# Altium schematic sheet 2_Battery indicator.schdoc
size 497 x 243 mm; Name: A_A4; Symbol: A_A4; Device: A_A4; @Project Name: TUD-EnergyHarvestingConsole_2022-08-29_17-01-09; REV: 1.0; Date: 2022-07-30; Sheet: 1/1; Draw By: Alejandro Cabrerizo; Convert to PCB: yes; Add into BOM: yes
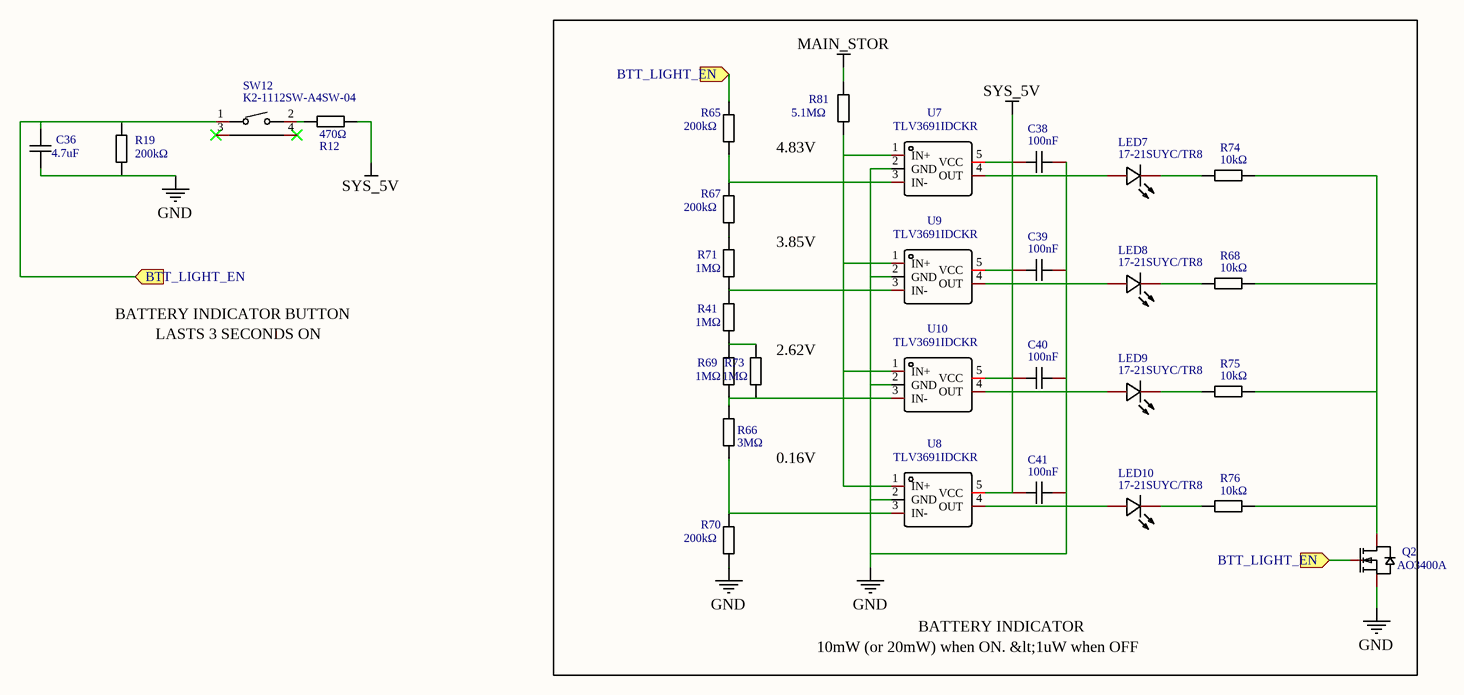
[diagram p0: 2_Battery indicator.schdoc]

## Parts
C36  4.7uF  [C0603]
C38  100nF  [C0603]
C39  100nF  [C0603]
C40  100nF  [C0603]
C41  100nF  [C0603]
LED7  17-21SUYC/TR8  [LED0805-RD]
LED8  17-21SUYC/TR8  [LED0805-RD]
LED9  17-21SUYC/TR8  [LED0805-RD]
LED10  17-21SUYC/TR8  [LED0805-RD]
Q2  AO3400A  [SOT-23-3_L2.9-W1.3-P1.90-LS2.4-BR]
R12  470Ω  [R0603]
R19  200kΩ  [R0603]
R41  1MΩ  [R0603]
R65  200kΩ  [R0603]
R66  3MΩ  [R0603]
R67  200kΩ  [R0603]
R68  10kΩ  [R0603]
R69  1MΩ  [R0603]
R70  200kΩ  [R0603]
R71  1MΩ  [R0603]
R73  1MΩ  [R0603]
R74  10kΩ  [R0603]
R75  10kΩ  [R0603]
R76  10kΩ  [R0603]
R81  5.1MΩ  [R0603]
SW12  K2-1112SW-A4SW-04  [KEY-TH_K2-1112SW-AXXW-XX]
U7  TLV3691IDCKR  [SC-70-5_L2.1-W1.3-P0.65-LS2.1-BR]
U8  TLV3691IDCKR  [SC-70-5_L2.1-W1.3-P0.65-LS2.1-BR]
U9  TLV3691IDCKR  [SC-70-5_L2.1-W1.3-P0.65-LS2.1-BR]
U10  TLV3691IDCKR  [SC-70-5_L2.1-W1.3-P0.65-LS2.1-BR]

## Ports
BTT_LIGHT_EN (in)

## Nets
GND: C36.1 C38.2 C39.2 C40.2 C41.2 Q2.2(S) R19.2 R70.1 U7.2(GND) U8.2(GND) U9.2(GND) U10.2(GND)
MAIN_STOR: R81.1
SYS_5V: C38.1 C39.1 C40.1 C41.1 R12.2 U7.5(VCC) U8.5(VCC) U9.5(VCC) U10.5(VCC)
BTT_LIGHT_EN: C36.2 Q2.1(G) R19.1 R65.2 SW12.1 ; port BTT_LIGHT_EN
NetLED7_1: LED7.1(-) R74.1
NetLED7_2: LED7.2(+) U7.4(OUT)
NetLED8_1: LED8.1(-) R68.1
NetLED8_2: LED8.2(+) U9.4(OUT)
NetLED9_1: LED9.1(-) R75.1
NetLED9_2: LED9.2(+) U10.4(OUT)
NetLED10_1: LED10.1(-) R76.1
NetLED10_2: LED10.2(+) U8.4(OUT)
NetQ2_3: Q2.3(D) R68.2 R74.2 R75.2 R76.2
NetR12_1: R12.1 SW12.2
NetR41_1: R41.1 R69.2 R73.2
NetR41_2: R41.2 R71.1 U9.3(IN-)
NetR65_1: R65.1 R67.2 U7.3(IN-)
NetR66_1: R66.1 R70.2 U8.3(IN-)
NetR66_2: R66.2 R69.1 R73.1 U10.3(IN-)
NetR67_1: R67.1 R71.2
NetR81_2: R81.2 U7.1(IN+) U8.1(IN+) U9.1(IN+) U10.1(IN+)

Not connected (* = marked no-connect by the designer): SW12 3* 4*

## Notes on the sheet
- 4.83V
- 3.85V
- BATTERY INDICATOR BUTTON
- LASTS 3 SECONDS ON
- (near R73) 2.62V
- 0.16V
- 10mW (or 20mW) when ON. &lt;1uW when OFF
- BATTERY INDICATOR
- 1
- 2
- 3
- 4
- 5
- A
- B
- C
- D
- TITLE:
- TUD-EnergyHarvestingConsole_2022-08-29_17-01-09
- REV:
- 1.0
- Date:
- Company:
- 2022-07-30
- Drawn By:
- Alejandro Cabrerizo
- Sheet:
- 1/1

## Library data of the parts
C36 = CL10A475KO8NNNC: Manufacturer: SAMSUNG; Convert to PCB: yes; Name: 4.7uF; Symbol: 4.7uF; Device: CL10A475KO8NNNC; Supplier: LCSC; Manufacturer Part: CL10A475KO8NNNC; Supplier Part: C19666; JLCPCB Part Class: Basic Part; Add into BOM: yes; Origin Footprint: C0603
C38-C41 = CC0603KRX7R9BB104: Manufacturer: YAGEO; Convert to PCB: yes; Name: 100nF; Symbol: 100nF; Device: CC0603KRX7R9BB104; Supplier: LCSC; Manufacturer Part: CC0603KRX7R9BB104; Supplier Part: C14663; JLCPCB Part Class: Basic; Add into BOM: yes; Origin Footprint: C0603
LED7-LED10 = 17-21SUYC/TR8: Manufacturer: KENTO; Convert to PCB: yes; Name: 17-21SUYC/TR8; Symbol: 17-21SUYC/TR8; Device: 17-21SUYC/TR8; Supplier: LCSC; Manufacturer Part: 17-21SUYC/TR8; Supplier Part: C2296; JLCPCB Part Class: Basic Part; Add into BOM: yes; Origin Footprint: LED0805-RD
Q2 = AO3400A: Manufacturer: HUASHUO(华朔); Convert to PCB: yes; Name: AO3400A; Symbol: AO3400A; Device: AO3400A; Supplier: LCSC; Supplier Part: C700953; Manufacturer Part: AO3400A; JLCPCB Part Class: Extended Part; Add into BOM: yes; Origin Footprint: SOT-23-3_L2.9-W1.3-P1.90-LS2.4-BR
R12 = 0603WAF4700T5E: Manufacturer: UniOhm; Resistance: 470; Convert to PCB: yes; Name: 470Ω; Symbol: 470Ω; Device: 0603WAF4700T5E; Supplier: LCSC; Manufacturer Part: 0603WAF4700T5E; Supplier Part: C23179; JLCPCB Part Class: Basic Part; Add into BOM: yes; Origin Footprint: R0603
R19 R65 R67 R70 = 0603WAF2003T5E: Manufacturer: UniOhm; Resistance: 200K; Convert to PCB: yes; Name: 200kΩ; Symbol: 200kΩ; Device: 0603WAF2003T5E; Supplier: LCSC; Manufacturer Part: 0603WAF2003T5E; Supplier Part: C25811; JLCPCB Part Class: Basic Part; Add into BOM: yes; Origin Footprint: R0603
R41 R69 R71 R73 = 0603WAF1004T5E: Manufacturer: UniOhm; Resistance: 1M; Convert to PCB: yes; Name: 1MΩ; Symbol: 1MΩ; Device: 0603WAF1004T5E; Supplier: LCSC; Manufacturer Part: 0603WAF1004T5E; Supplier Part: C22935; JLCPCB Part Class: Basic Part; Add into BOM: yes; Origin Footprint: R0603
R66 = 0603WAF3004T5E: Manufacturer: UniOhm; Resistance: 3M; Convert to PCB: yes; Name: 3MΩ; Symbol: 3MΩ; Device: 0603WAF3004T5E; Supplier: LCSC; Manufacturer Part: 0603WAF3004T5E; Supplier Part: C23156; JLCPCB Part Class: Basic Part; Add into BOM: yes; Origin Footprint: R0603
R68 R74-R76 = 0603WAF1002T5E: Manufacturer: UniOhm; Resistance: 10K; Convert to PCB: yes; Name: 10kΩ; Symbol: 10kΩ; Device: 0603WAF1002T5E; Supplier: LCSC; Manufacturer Part: 0603WAF1002T5E; Supplier Part: C25804; JLCPCB Part Class: Basic Part; Add into BOM: yes; Origin Footprint: R0603
R81 = 0603WAF5104T5E: Manufacturer: UniOhm; Resistance: 5.1M; Convert to PCB: yes; Name: 5.1MΩ; Symbol: 5.1MΩ; Device: 0603WAF5104T5E; Supplier: LCSC; Manufacturer Part: 0603WAF5104T5E; Supplier Part: C13320; JLCPCB Part Class: Basic Part; Add into BOM: yes; Origin Footprint: R0603
SW12 = K2-1112SW-A4SW-04: Manufacturer: Korean Hroparts Elec; Convert to PCB: yes; Name: K2-1112SW-A4SW-04; Symbol: K2-1112SW-A4SW-04; Device: K2-1112SW-A4SW-04; Supplier: LCSC; Supplier Part: C223811; Manufacturer Part: K2-1112SW-A4SW-04; JLCPCB Part Class: Extended Part; Add into BOM: yes; Origin Footprint: KEY-TH_K2-1112SW-AXXW-XX
U7-U10 = TLV3691IDCKR: Manufacturer: TI(德州仪器); Convert to PCB: yes; Name: TLV3691IDCKR; Symbol: TLV3691IDCKR; Device: TLV3691IDCKR; Supplier: LCSC; Supplier Part: C180352; Manufacturer Part: TLV3691IDCKR; JLCPCB Part Class: Extended Part; Add into BOM: yes; Origin Footprint: SC-70-5_L2.1-W1.3-P0.65-LS2.1-BR